# EAGLE schematic letter_p (EAGLE 8.2.2)
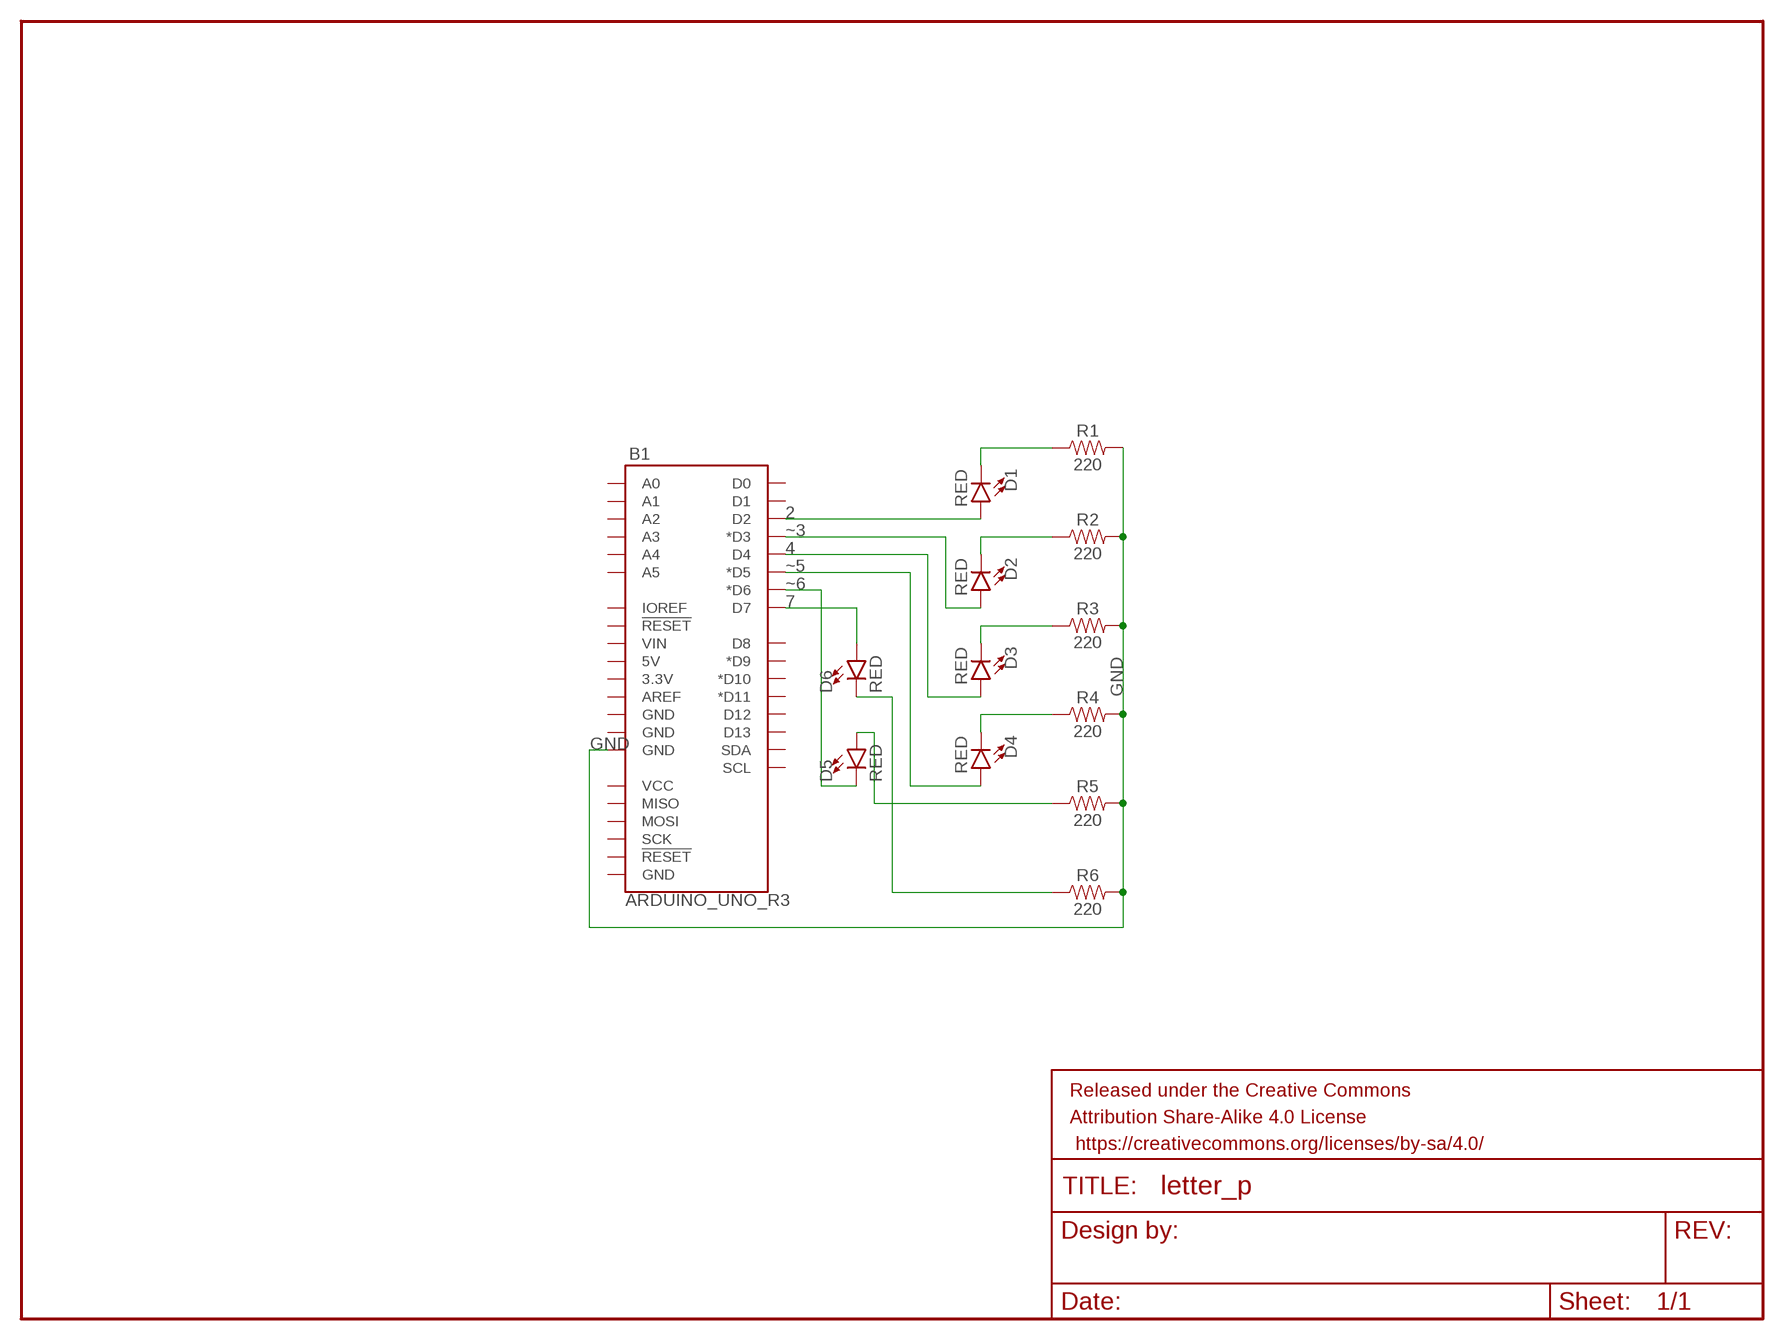
[diagram p0: schematic, sheet 1]

## Parts
B1  ARDUINO_UNO_R3  [ARDUINO_R3]
D1  RED  LED5MM  [LED_5MM]
D2  RED  LED5MM  [LED_5MM]
D3  RED  LED5MM  [LED_5MM]
D4  RED  LED5MM  [LED_5MM]
D5  RED  LED5MM  [LED_5MM]
D6  RED  LED5MM  [LED_5MM]
FRAME1  FRAME-LETTER  [CREATIVE_COMMONS]
R1  220  1KOHM-HORIZ-1/4W-5%  [AXIAL-0.3]
R2  220  1KOHM-HORIZ-1/4W-5%  [AXIAL-0.3]
R3  220  1KOHM-HORIZ-1/4W-5%  [AXIAL-0.3]
R4  220  1KOHM-HORIZ-1/4W-5%  [AXIAL-0.3]
R5  220  1KOHM-HORIZ-1/4W-5%  [AXIAL-0.3]
R6  220  1KOHM-HORIZ-1/4W-5%  [AXIAL-0.3]

## Nets
2: B1.D2 D1.A
4: B1.D4 D3.A
7: B1.D7 D6.A
GND: B1.GND@2(GND) R1.P$2 R2.P$2 R3.P$2 R4.P$2 R5.P$2 R6.P$2
N$7: D1.K(C) R1.P$1
N$8: D2.K(C) R2.P$1
N$9: D3.K(C) R3.P$1
N$10: D4.K(C) R4.P$1
N$11: D5.A R5.P$1
N$12: D6.K(C) R6.P$1
~3: B1.D3(*D3) D2.A
~5: B1.D5(*D5) D4.A
~6: B1.D6(*D6) D5.K(C)
Unconnected: B1.3.3V B1.5V B1.A0 B1.A1 B1.A2 B1.A3 B1.A4 B1.A5 B1.AREF B1.D0 B1.D1 B1.D8 B1.D9(*D9) B1.D10(*D10) B1.D11(*D11) B1.D12 B1.D13 B1.GND@1(GND) B1.GND@3(GND) B1.GND@4(GND) B1.IOREF B1.MISO B1.MOSI B1.RESET@1(!RESET!) B1.RESET@2(!RESET!) B1.SCK B1.SCL B1.SDA B1.VCC B1.VIN

## Library data of the parts
B1 = SparkFun-Boards:ARDUINO_UNO_R3: Arduino R3 Footprint with SPI header Arduino Uno R3 Compatible Footprint. Matches PCB size of the original board. SparkFun Products: SAMD21 Dev Breakout <https://www.sparkfun.com/products/13672> RedBoard <https://www.sparkfun.com/products/12757> R3 Stackable Headers <https://www.sparkfun.com/products/11417>
D1-D6 = SparkFun-LED:LED: LED (Generic) Standard schematic elements and footprints for 5mm, 3mm, 1206, and 0603 sized LEDs. Generic LEDs with no color specified.
FRAME1 = SparkFun-Aesthetics:FRAME-LETTER: Schematic Frame - Letter Standard 8.5x11 US Letter frame
R1-R6 = SparkFun-Resistors:1KOHM: 1kΩ resistor A resistor is a passive two-terminal electrical component that implements electrical resistance as a circuit element. Resistors act to reduce current flow, and, at the same time, act to lower voltage levels within circuits. - Wikipedia; PROD_ID: RES-08380; VALUE: 1k